# EAGLE schematic TRNG (EAGLE 9.5.2)
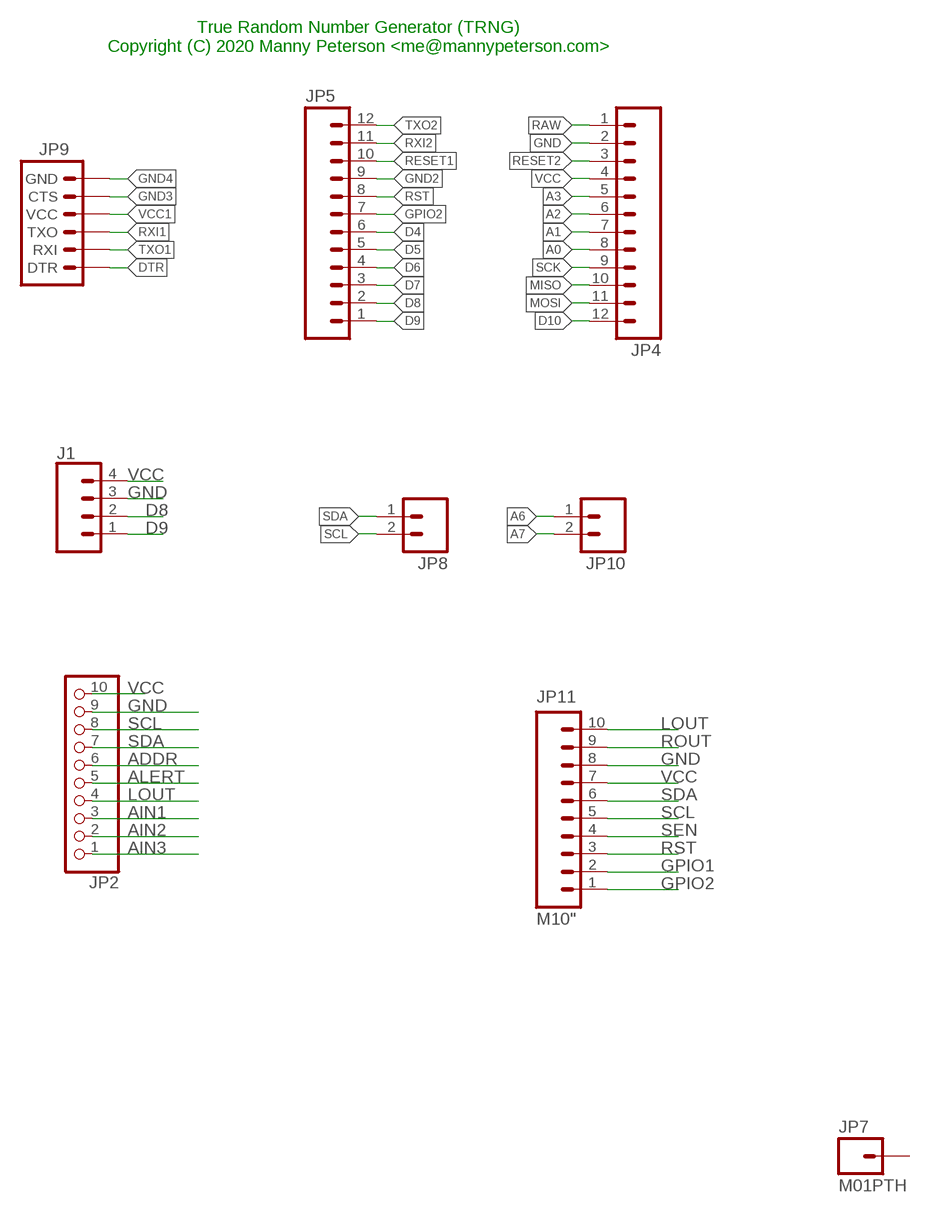
[diagram p0: schematic, sheet 1]

## Parts
J1  CONN_04PTH  [1X04]
JP2  HEADER-1X1070MIL  [1X10_ROUND70]
JP4  M12PTH  [1X12]
JP5  M12PTH  [1X12]
JP7  M01PTH  [1X01]
JP8  M02PTH  [1X02]
JP9  ARDUINO_SERIAL_PROGRAMPTH  [1X06]
JP10  M02PTH  [1X02]
JP11  M10"  [1X10]

## Nets
A0: JP4.8
A1: JP4.7
A2: JP4.6
A3: JP4.5
A6: JP10.1
A7: JP10.2
ADDR: JP2.6
AIN1: JP2.3
AIN2: JP2.2
AIN3: JP2.1
ALERT: JP2.5
D4: JP5.6
D5: JP5.5
D6: JP5.4
D7: JP5.3
D8: J1.2 JP5.2
D9: J1.1 JP5.1
D10: JP4.12
DTR: JP9.1(DTR)
GND: J1.3 JP2.9 JP4.2 JP11.8
GND2: JP5.9
GND3: JP9.5(CTS)
GND4: JP9.6(GND)
GPIO1: JP11.2
GPIO2: JP5.7 JP11.1
LOUT: JP2.4 JP11.10
MISO: JP4.10
MOSI: JP4.11
RAW: JP4.1
RESET1: JP5.10
RESET2: JP4.3
ROUT: JP11.9
RST: JP5.8 JP11.3
RXI1: JP9.3(TXO)
RXI2: JP5.11
SCK: JP4.9
SCL: JP2.8 JP8.2 JP11.5
SDA: JP2.7 JP8.1 JP11.6
SEN: JP11.4
TXO1: JP9.2(RXI)
TXO2: JP5.12
VCC: J1.4 JP2.10 JP4.4 JP11.7
VCC1: JP9.4(VCC)
Unconnected: JP7.1

## Notes on the sheet
- True Random Number Generator (TRNG)
  Copyright (C) 2020 Manny Peterson <me@mannypeterson.com>

## Library data of the parts
J1 = SparkFun-Connectors:CONN_04: Multi connection point. Often used as Generic Header-pin footprint for 0.1 inch spaced/style header connections On any of the 0.1 inch spaced packages, you can populate with these: Break Away Headers - Straight <https://www.sparkfun.com/products/116> (PRT-00116) Break Away Male Headers - Right Angle <https://www.sparkfun.com/products/553> (PRT-00553) Female Headers <https://www.sparkfun.com/products/115> (PRT-00115) Break Away Headers - Machine Pin <https://www.sparkfun.com/products/117> (PRT-00117) Break Away Female Headers - Swiss Machine Pin <https://www.sparkfun.com/products/743> (PRT-00743) For SCREWTERMINALS and SPRING TERMINALS visit here: Screw Terimnals on SparkFun.com <https://www.sparkfun.com/search/results?term=Screw+Terminals> (5mm/3.5mm/2.54mm spacing) This device is also useful as a general connection point to wire up your design to another part of your project. Our various solder wires solder well into these plated through hole pads. Hook-Up Wire - Assortment (Stranded, 22 AWG) <https://www.sparkfun.com/products/11375> (PRT-11375) Hook-Up Wire - Assortment (Solid Core, 22 AWG) <https://www.sparkfun.com/products/11367> (PRT-11367) View the entire wire category on our website here <https://www.sparkfun.com/categories/141> Special notes: Molex polarized connector foot print use with SKU : PRT-08231 with associated crimp pins and housings. 1MM SMD Version SKU: PRT-10208; PROD_ID: CONN-09696
JP2 = microbuilder:HEADER-1X10: PIN HEADER
JP4 JP5 = SparkFun:M12: Header 12 Standard 12-pin 0.1" header. Use with straight break away headers (SKU : PRT-00116), right angle break away headers (PRT-00553), swiss pins (PRT-00743), machine pins (PRT-00117), and female headers (PRT-00115).
JP7 = SparkFun-Connectors:M01: Header 1 Standard 1-pin 0.1" header. Use with straight break away headers (SKU : PRT-00116), right angle break away headers (PRT-00553), swiss pins (PRT-00743), machine pins (PRT-00117), and female headers (PRT-00115).
JP8 JP10 = SparkFun:M02: Header 2 Standard 2-pin 0.1" header. Use with straight break away headers (SKU : PRT-00116), right angle break away headers (PRT-00553), swiss pins (PRT-00743), machine pins (PRT-00117), and female headers (PRT-00115). Molex polarized connector foot print use with SKU : PRT-08233 with associated crimp pins and housings.
JP9 = SparkFun:ARDUINO_SERIAL_PROGRAM
JP11 = SparkFun-Connectors:M10: Header 10 Standard 10-pin 0.1" header. Use with straight break away headers (SKU : PRT-00116), right angle break away headers (PRT-00553), swiss pins (PRT-00743), machine pins (PRT-00117), and female headers (PRT-00115).